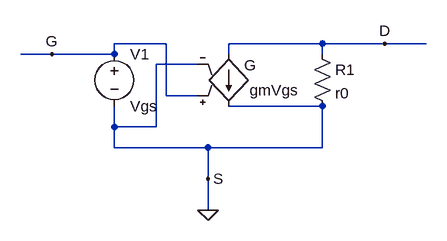
[diagram p0: schematic ssm.asc]
ssm.asc, the LTspice schematic file:
Version 4
SHEET 1 880 680
WIRE 176 48 96 48
WIRE 416 48 272 48
WIRE 512 48 416 48
WIRE 576 48 512 48
WIRE 0 64 -48 64
WIRE 96 64 96 48
WIRE 96 64 0 64
WIRE 272 64 272 48
WIRE 416 64 416 48
WIRE 224 80 160 80
WIRE 176 128 176 48
WIRE 224 128 176 128
WIRE 416 144 272 144
WIRE 96 176 96 144
WIRE 160 176 160 80
WIRE 160 176 96 176
WIRE 96 208 96 176
WIRE 240 208 96 208
WIRE 416 208 416 144
WIRE 416 208 240 208
WIRE 240 256 240 208
WIRE 240 304 240 256
FLAG 240 304 0
FLAG 0 64 G
FLAG 512 48 D
FLAG 240 256 S
SYMBOL voltage 96 48 R0
SYMATTR InstName V1
SYMATTR Value Vgs
SYMBOL g 272 160 M180
WINDOW 0 32 40 Left 2
WINDOW 3 24 79 Left 2
SYMATTR InstName gmVgs
SYMBOL res 400 48 R0
SYMATTR InstName R1
SYMATTR Value r0

The netlist it stands for:
* ssm.asc
V1 G 0 Vgs
gmVgs D 0 G 0 G
R1 D 0 r0
.backanno
.end